# Altium schematic sheet 019_CC1352P.SchDoc
size 420 x 297 mm; Page Create Date: May 29, 2006; WebSite: https://www.seeedstudio.com; Variant Name: <Core Design>; Page Number: 19; Drawing: qxn; Schematic Name: BeaglePlay; Page Size: A3; Comment: Seeed Title; Page Count: 22; Page Name: 019_CC1352P; Company: Seeed Studio; RevCode: v0.2; DsnPath: C:\Users\a0488739\Documents\GitHub\beagleplay\allegro\DVT\BEAGLEPLAYV020_220915.DSN; SchematicName: BeaglePlay; PageName: 019_CC1352P; PageSize: A3; TopSchematic: True
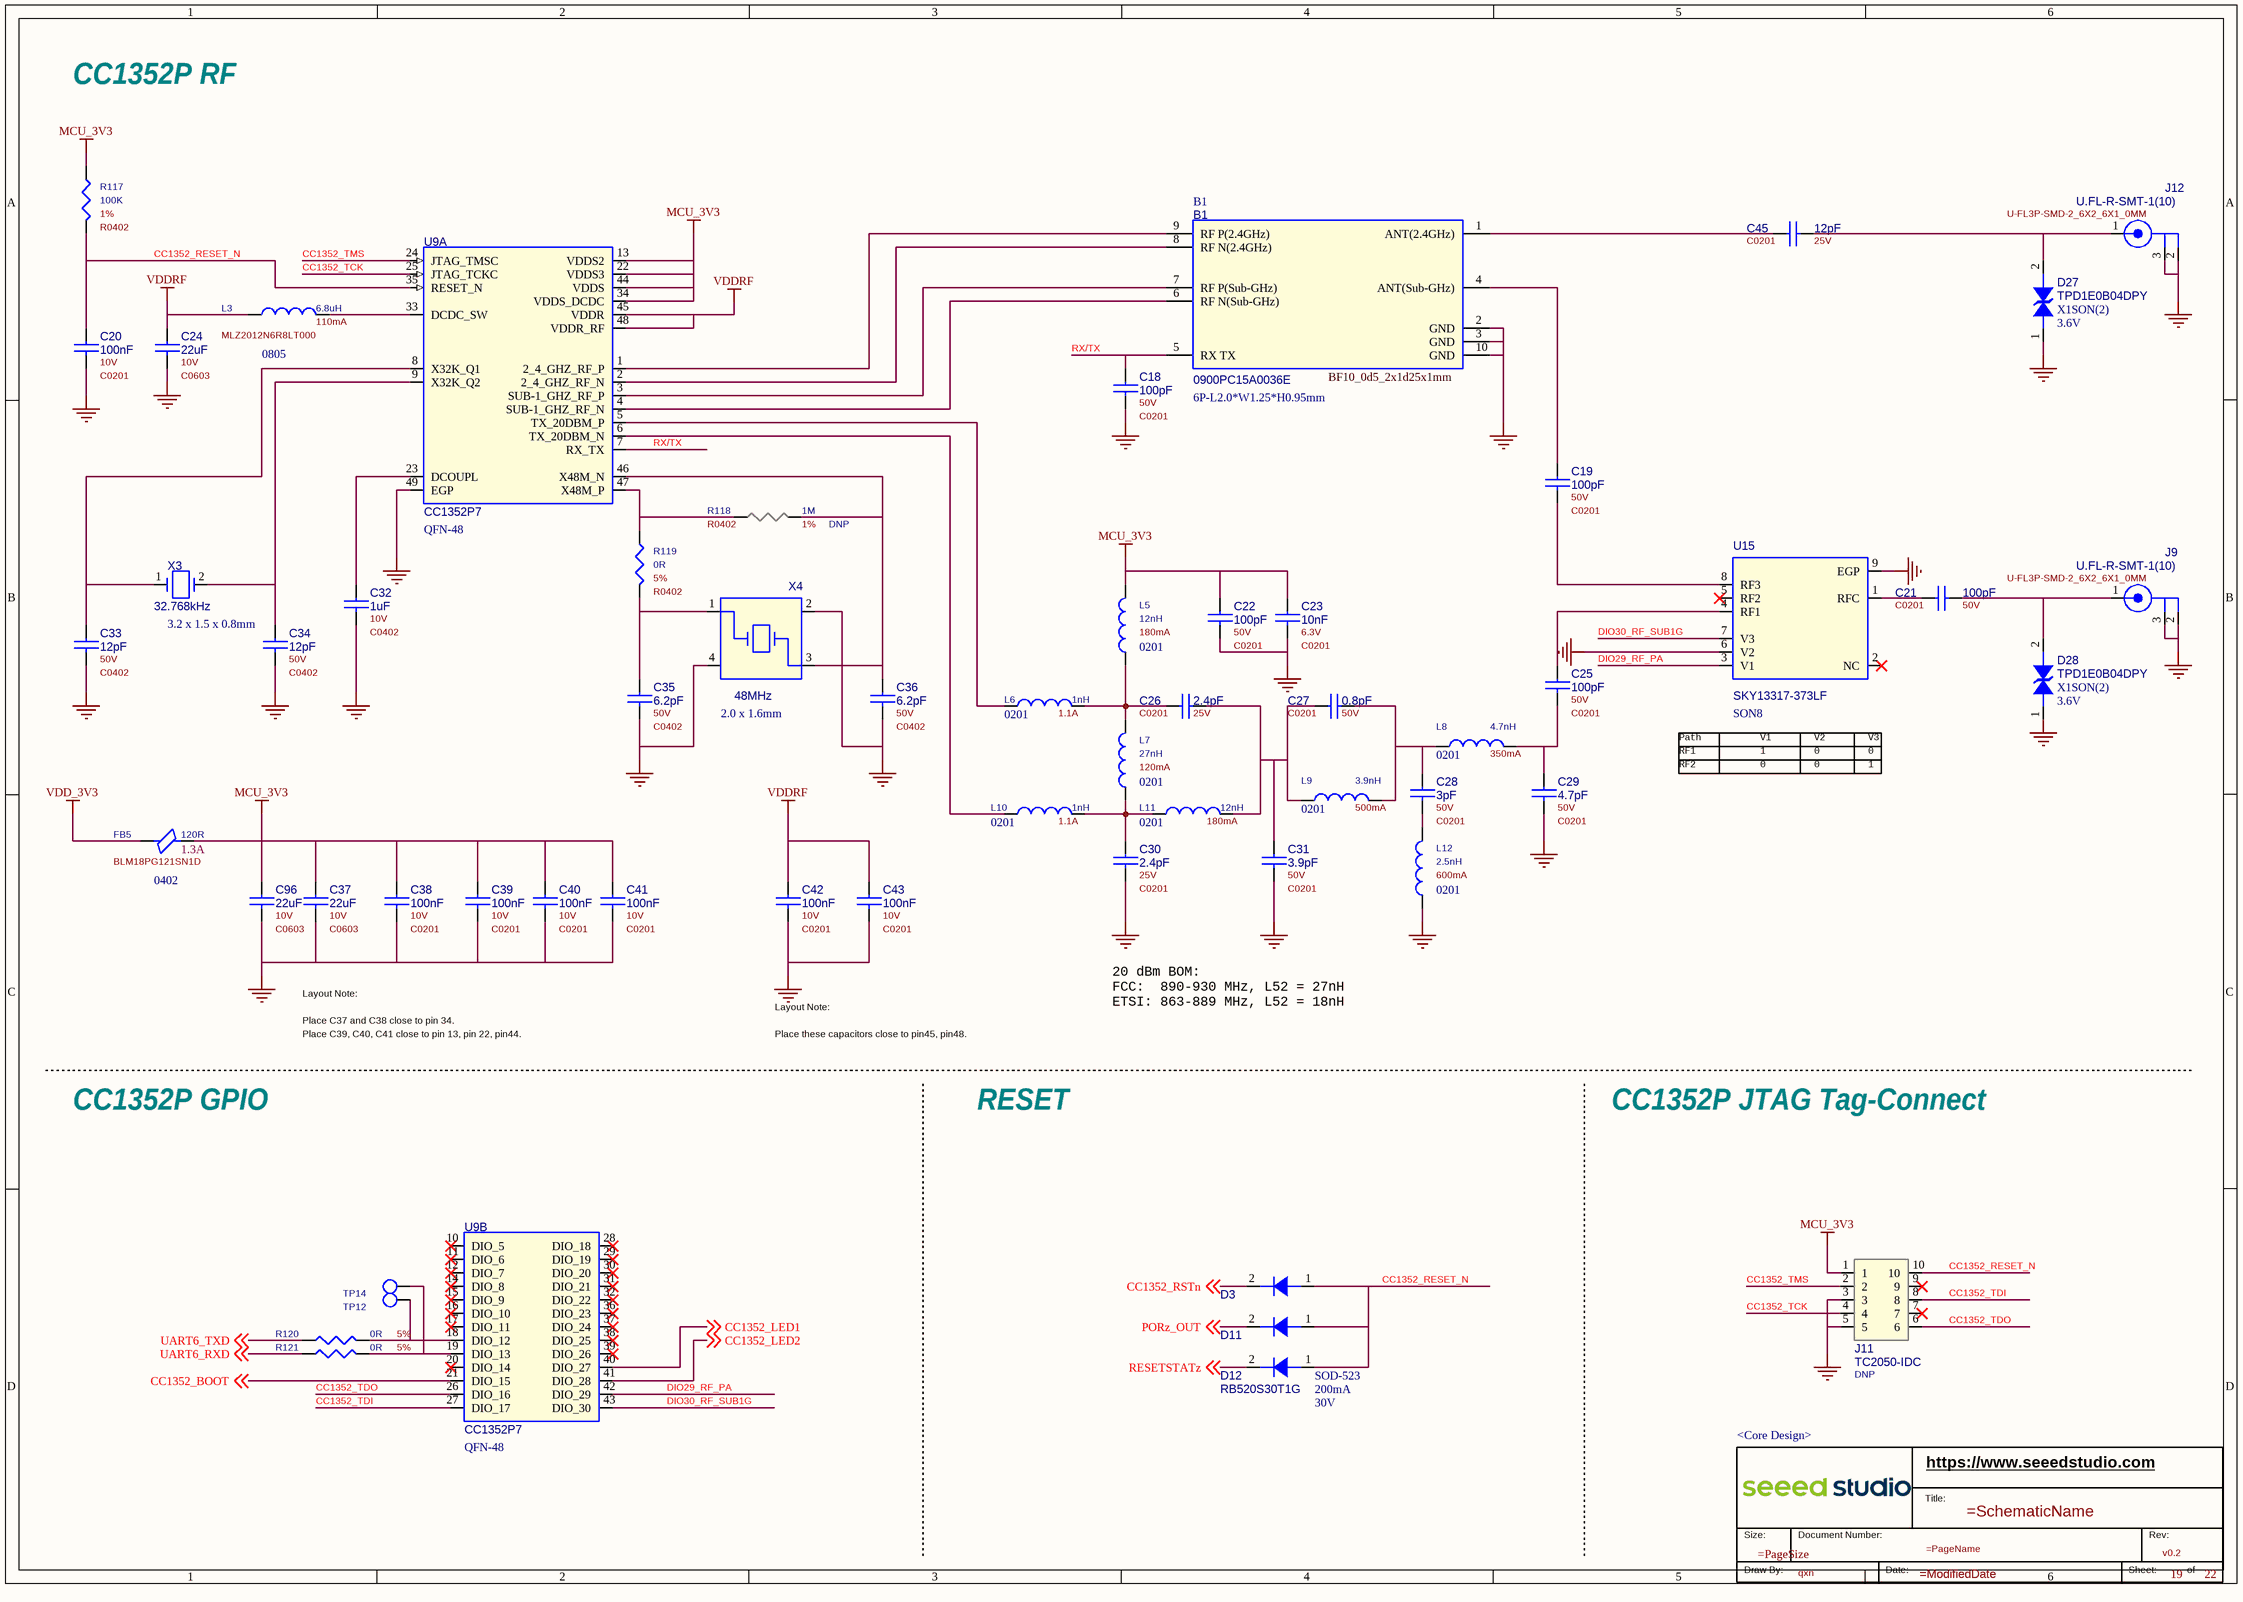
[diagram p0: 019_CC1352P.SchDoc]

## Parts
*  RevCode: v0.2  Page Number: 19  Page Count: 22  Drawing: qxn  Variant Name: <Core Design>  (hidden comment: Seeed Title)  (graphical)
B1  Reference: B1  Package Size: 6P-L2.0*W1.25*H0.95mm  [BF10_0d5_2x1d25x1mm]  (hidden comment: 0900PC15A0036E)
C18  value 100pF  Rating: 50V  [C0201]  (hidden comment: CC)
C19  value 100pF  Rating: 50V  [C0201]  (hidden comment: CC)
C20  value 100nF  Rating: 10V  [C0201]  (hidden comment: CC)
C21  value 100pF  Rating: 50V  [C0201]  (hidden comment: CC)
C22  value 100pF  Rating: 50V  [C0201]  (hidden comment: CC)
C23  value 10nF  Rating: 6.3V  [C0201]  (hidden comment: CC)
C24  value 22uF  Rating: 10V  [C0603]  (hidden comment: CC)
C25  value 100pF  Rating: 50V  [C0201]  (hidden comment: CC)
C26  value 2.4pF  Rating: 25V  [C0201]  (hidden comment: CC)
C27  value 0.8pF  Rating: 50V  [C0201]  (hidden comment: CC)
C28  value 3pF  Rating: 50V  [C0201]  (hidden comment: CC)
C29  value 4.7pF  Rating: 50V  [C0201]  (hidden comment: CC)
C30  value 2.4pF  Rating: 25V  [C0201]  (hidden comment: CC)
C31  value 3.9pF  Rating: 50V  [C0201]  (hidden comment: CC)
C32  value 1uF  Rating: 10V  [C0402]  (hidden comment: CC)
C33  value 12pF  Rating: 50V  [C0402]  (hidden comment: CC)
C34  value 12pF  Rating: 50V  [C0402]  (hidden comment: CC)
C35  value 6.2pF  Rating: 50V  [C0402]  (hidden comment: CC)
C36  value 6.2pF  Rating: 50V  [C0402]  (hidden comment: CC)
C37  value 22uF  Rating: 10V  [C0603]  (hidden comment: CC)
C38  value 100nF  Rating: 10V  [C0201]  (hidden comment: CC)
C39  value 100nF  Rating: 10V  [C0201]  (hidden comment: CC)
C40  value 100nF  Rating: 10V  [C0201]  (hidden comment: CC)
C41  value 100nF  Rating: 10V  [C0201]  (hidden comment: CC)
C42  value 100nF  Rating: 10V  [C0201]  (hidden comment: CC)
C43  value 100nF  Rating: 10V  [C0201]  (hidden comment: CC)
C45  value 12pF  Rating: 25V  [C0201]  (hidden comment: CC)
C96  value 22uF  Rating: 10V  [C0603]  (hidden comment: CC)
D3  D  [sod_523]  (value not drawn)
D11  D  [sod_523]  (value not drawn)
D12  value RB520S30T1G  Package Size: SOD-523  Peak Forward Current: 200mA  Repetitive Reverse Voltage Maximum: 30V  [sod_523]  (hidden comment: D)
D27  value TPD1E0B04DPY  Package Size: X1SON(2)  Rated Voltage: 3.6V  [x1son2_0d65_1x0_6x0_45mm]  (hidden comment: DIODE TVS BI-DIR)
D28  value TPD1E0B04DPY  Package Size: X1SON(2)  Rated Voltage: 3.6V  [x1son2_0d65_1x0_6x0_45mm]  (hidden comment: DIODE TVS BI-DIR)
FB5  value 120R  Rating: 1.3A  Manufacturer Part Number: BLM18PG121SN1D  Package Size: 0402  [L0402]  (hidden comment: FB)
J9  value U.FL-R-SMT-1(10)  [U-FL3P-SMD-2_6X2_6X1_0MM]  (hidden comment: RF ANT 3P)
J11  value TC2050-IDC  ASSY: DNP  [Connect10_1d27_12_4x6_7mm]  (hidden comment: Header 2X5_1)
J12  value U.FL-R-SMT-1(10)  [U-FL3P-SMD-2_6X2_6X1_0MM]  (hidden comment: RF ANT 3P)
L3  value 6.8uH  Manufacturer Part Number: MLZ2012N6R8LT000  Rating: 110mA  Package Size: 0805  [L0805]  (hidden comment: L)
L5  value 12nH  Rating: 180mA  Package Size: 0201  [L0201]  (hidden comment: L)
L6  value 1nH  Rating: 1.1A  Package Size: 0201  [L0201]  (hidden comment: L)
L7  value 27nH  Rating: 120mA  Package Size: 0201  [L0201]  (hidden comment: L)
L8  value 4.7nH  Rating: 350mA  Package Size: 0201  [L0201]  (hidden comment: L)
L9  value 3.9nH  Rating: 500mA  Package Size: 0201  [L0201]  (hidden comment: L)
L10  value 1nH  Rating: 1.1A  Package Size: 0201  [L0201]  (hidden comment: L)
L11  value 12nH  Rating: 180mA  Package Size: 0201  [L0201]  (hidden comment: L)
L12  value 2.5nH  Rating: 600mA  Package Size: 0201  [L0201]  (hidden comment: L)
R117  value 100K  Rating: 1%  [R0402]  (hidden comment: R)
R118  value 1M  Rating: 1%  ASSY: DNP  [R0402]  (hidden comment: R)
R119  value 0R  Rating: 5%  [R0402]  (hidden comment: R)
R120  value 0R  Rating: 5%  [R0402]  (hidden comment: R)
R121  value 0R  Rating: 5%  [R0402]  (hidden comment: R)
TP12  Test Point  [tp1-8040]  (value not drawn)
TP14  Test Point  [tp1-8040]  (value not drawn)
U9  value CC1352P7  Package Size: QFN-48  [qfn48_0d5_7x7mm]  (hidden comment: CC1352P1F3RGZ)  (parts A,B of 2)
U15  Package Size: SON8  [son8p_150x150x50mm]  (hidden comment: SKY13317-373LF)
X3  value 32.768kHz  Package Size: 3.2 x 1.5 x 0.8mm  [X2_SMD_3_2X1_5MM]  (hidden comment: XTAL_2P)
X4  value 48MHz  Package Size: 2.0 x 1.6mm  [x4_smd_2_0x1_6mm]  (hidden comment: XTAL_4P)

## Nets
GND: B1.2(GND) B1.3(GND) B1.10(GND) C18.2 C20.2 C22.2 C23.2 C24.2 C29.2 C30.2 C31.2 C32.2 C33.2 C34.2 C35.2 C36.2 C37.2 C38.2 C39.2 C40.2 C41.2 C42.2 C43.2 C96.2 D27.1 D28.1 J9.2(SHIELD1) J9.3(SHIELD2) J11.3 J11.5 J12.2(SHIELD1) J12.3(SHIELD2) L12.1 U9.49(EGP) U15.6(V2) U15.9(EGP) X4.2 X4.4
MCU_3V3: C22.1 C23.1 C37.1 C38.1 C39.1 C40.1 C41.1 C96.1 FB5.2 J11.1 L5.2 R117.1 U9.13(VDDS2) U9.22(VDDS3) U9.34(VDDS_DCDC) U9.44(VDDS)
VDD_3V3: FB5.1
VDDRF: C24.1 C42.1 C43.1 L3.1 U9.45(VDDR) U9.48(VDDR_RF)
CC1352_BOOT: U9.21(DIO_15) ; off-sheet CC1352_BOOT
CC1352_LED1: U9.40(DIO_27) ; off-sheet CC1352_LED1
CC1352_LED2: U9.41(DIO_28) ; off-sheet CC1352_LED2
CC1352_RESET_N: C20.1 D3.1(A) D11.1(A) D12.1(A) J11.10 R117.2 U9.35(RESET_N)
CC1352_RSTn: D3.2(C) ; off-sheet CC1352_RSTn
CC1352_TCK: J11.4 U9.25(JTAG_TCKC)
CC1352_TDI: J11.8 U9.27(DIO_17)
CC1352_TDO: J11.6 U9.26(DIO_16)
CC1352_TMS: J11.2 U9.24(JTAG_TMSC)
DIO29_RF_PA: U9.42(DIO_29) U15.3(V1)
DIO30_RF_SUB1G: U9.43(DIO_30) U15.7(V3)
PORz_OUT: D11.2(C) ; off-sheet PORz_OUT
RESETSTATz: D12.2(C) ; off-sheet RESETSTATz
RX/TX: B1.5(RX_TX) C18.1 U9.7(RX_TX)
UART6_RXD: R121.1 ; off-sheet UART6_RXD
UART6_TXD: R120.1 ; off-sheet UART6_TXD
NetB1_1: B1.1(ANT(2.4GHz)) C45.1
NetB1_4: B1.4(ANT(Sub-GHz)) C19.1
NetB1_6: B1.6(RF_N(Sub-GHz)) U9.4(SUB-1_GHZ_RF_N)
NetB1_7: B1.7(RF_P(Sub-GHz)) U9.3(SUB-1_GHZ_RF_P)
NetB1_8: B1.8(RF_N(2.4GHz)) U9.2(2_4_GHZ_RF_N)
NetB1_9: B1.9(RF_P(2.4GHz)) U9.1(2_4_GHZ_RF_P)
NetC19_2: C19.2 U15.8(RF3)
NetC21_1: C21.1 U15.1(RFC)
NetC21_2: C21.2 D28.2 J9.1(CENTER)
NetC25_1: C25.1 U15.4(RF1)
NetC25_2: C25.2 C29.1 L8.2
NetC26_1: C26.1 L5.1 L6.2 L7.2
NetC26_2: C26.2 C27.1 C31.1 L9.1 L11.2
NetC27_2: C27.2 C28.1 L8.1 L9.2
NetC28_2: C28.2 L12.2
NetC30_1: C30.1 L7.1 L10.2 L11.1
NetC32_1: C32.1 U9.23(DCOUPL)
NetC33_1: C33.1 U9.8(X32K_Q1) X3.1
NetC34_1: C34.1 U9.9(X32K_Q2) X3.2
NetC35_1: C35.1 R119.2 X4.1
NetC36_1: C36.1 R118.2 U9.46(X48M_N) X4.3
NetC45_2: C45.2 D27.2 J12.1(CENTER)
NetL3_2: L3.2 U9.33(DCDC_SW)
NetL6_1: L6.1 U9.5(TX_20DBM_P)
NetL10_1: L10.1 U9.6(TX_20DBM_N)
NetR118_1: R118.1 R119.1 U9.47(X48M_P)
NetR120_2: R120.2 TP12.1(TP) U9.18(DIO_12)
NetR121_2: R121.2 TP14.1(TP) U9.19(DIO_13)

Not connected (* = marked no-connect by the designer): J11 7* 9*; U9 10(DIO_5)* 11(DIO_6)* 12(DIO_7)* 14(DIO_8)* 15(DIO_9)* 16(DIO_10)* 17(DIO_11)* 20(DIO_14)* 28(DIO_18)* 29(DIO_19)* 30(DIO_20)* 31(DIO_21)* 32(DIO_22)* 36(DIO_23)* 37(DIO_24)* 38(DIO_25)* 39(DIO_26)*; U15 2(NC)* 5(RF2)*

## Notes on the sheet
- CC1352P RF
- Path
- RF1
- RF2
- V1
- 0
- 1
- V2
- V3
- Layout Note:
- 20 dBm BOM:
  FCC:  890-930 MHz, L52 = 27nH
  ETSI: 863-889 MHz, L52 = 18nH
- Place C39, C40, C41 close to pin 13, pin 22, pin44.
- Place C37 and C38 close to pin 34.
- Place these capacitors close to pin45, pin48.
- CC1352P GPIO
- RESET
- CC1352P JTAG Tag-Connect
- (in symbol Seeed Title) https://www.seeedstudio.com; Title:; Size:; Document Number:; Rev:; Draw By:; Date:; Sheet:; of

## Library data of the parts
* = Seeed Title: Company: Seeed Studio; WebSite: https://www.seeedstudio.com; Schematic Name: =SchematicName; Page Size: =PageSize; Page Name: =PageName; Page Create Date: May 29, 2006; Page Modify Date: =ModifiedDate
B1 = 0900PC15A0036E: MISC, Balun, 0900PC15A0036E, SMD, 6P-L2.0*W1.25*H0.95mm; Manufacturer: Johanson; Company Part Status: BeaglePlay; PN: 310060581; CLASS: DISCRETE; PCB Footprint: BF10_0d5_2x1d25x1mm; Value: 0900PC15A0036E; Part Reference: B1; Manufacturer Part Number: 0900PC15A0036E; Manufacturer PN: 0900PC15A0036E
C18 = CC: CAP, Ceramic, SMD, 100pF, 5%, 50V, 0201; Part Reference: C18; Manufacturer PN: CC0201JRNPO9BN101; Company Part Status: BeaglePlay; Manufacturer Part Number: CC0402JRNPO9BN101; Manufacturer: YAGEO; CLASS: DISCRETE; PN: 302010420; Temperature Coefficient: NPO; PCB Footprint: C0201; Tolerance: 5%; Dielectric Type: Ceramic; Package Size: 0201; Temperature: -55¡ãC to 125¡ãC; Status: Testo PoE; Part Type: Ceramic
C19 = CC: CAP, Ceramic, SMD, 100pF, 5%, 50V, 0201; Part Reference: C19; Manufacturer: YAGEO; Manufacturer Part Number: CC0402JRNPO9BN101; Company Part Status: BeaglePlay; Manufacturer PN: CC0201JRNPO9BN101; Temperature Coefficient: NPO; PN: 302010420; CLASS: DISCRETE; PCB Footprint: C0201; Part Type: Ceramic; Status: Testo PoE; Temperature: -55¡ãC to 125¡ãC; Package Size: 0201; Dielectric Type: Ceramic; Tolerance: 5%
C20 = CC: CAP, Ceramic, SMD, 100nF, 10%, 10V, 0201; Part Reference: C20; Manufacturer PN: CC0201KRX5R6BB104; Company Part Status: ODYSSEY-i.MX8M; Manufacturer Part Number: CC0402KRX7R7BB104; Manufacturer: YAGEO; CLASS: DISCRETE; Temperature Coefficient: X5R; PN: 302010271; PCB Footprint: C0201; Tolerance: 10%; Dielectric Type: Ceramic; Package Size: 0201; Temperature: -55¡ãC to 125¡ãC; Status: BeagleBone Carrier Board; Part Type: Ceramic
C21 = CC: CAP, Ceramic, SMD, 100pF, 5%, 50V, 0201; Part Reference: C21; Manufacturer PN: CC0201JRNPO9BN101; Company Part Status: BeaglePlay; Manufacturer Part Number: CC0402JRNPO9BN101; Manufacturer: YAGEO; CLASS: DISCRETE; PN: 302010420; Temperature Coefficient: NPO; PCB Footprint: C0201; Tolerance: 5%; Dielectric Type: Ceramic; Package Size: 0201; Temperature: -55¡ãC to 125¡ãC; Status: Testo PoE; Part Type: Ceramic
C22 = CC: CAP, Ceramic, SMD, 100pF, 5%, 50V, 0201; Part Reference: C22; Manufacturer PN: CC0201JRNPO9BN101; Company Part Status: BeaglePlay; Manufacturer Part Number: CC0402JRNPO9BN101; Manufacturer: YAGEO; CLASS: DISCRETE; PN: 302010420; Temperature Coefficient: NPO; PCB Footprint: C0201; Tolerance: 5%; Dielectric Type: Ceramic; Package Size: 0201; Temperature: -55¡ãC to 125¡ãC; Status: Testo PoE; Part Type: Ceramic
C23 = CC: CAP, Ceramic, SMD, 10nF, 10%, 6.3V, 0201; Part Reference: C23; Manufacturer PN: CC0201KRX5R5BB103; Company Part Status: ODYSSEY-i.MX8M; Manufacturer: YAGEO; Manufacturer Part Number: CC0402KRX7R9BB103; CLASS: DISCRETE; Temperature Coefficient: X5R; PN: 302011831; PCB Footprint: C0201; Tolerance: 10%; Dielectric Type: Ceramic; Package Size: 0201; Part Type: Ceramic; Status: BeagleBone Carrier Board; Temperature: -55¡ãC to 125¡ãC
C24 = CC: CAP, Ceramic, SMD, 22uF, 20%, 10V, 0603; Part Reference: C24; Manufacturer PN: CC0603MRX5R6BB226; Manufacturer: YAGEO; CLASS: DISCRETE; Temperature Coefficient: X5R; PN: 302010411; PCB Footprint: C0603; Tolerance: 20%; Dielectric Type: Ceramic; Package Size: 0603; Manufacturer Part Number: CC0603MRX5R6BB226; Part Type: Ceramic; Temperature: -55¡ãC to 85¡ãC
C25 = CC: CAP, Ceramic, SMD, 100pF, 5%, 50V, 0201; Part Reference: C25; Manufacturer PN: CC0201JRNPO9BN101; Company Part Status: BeaglePlay; Manufacturer Part Number: CC0402JRNPO9BN101; Manufacturer: YAGEO; CLASS: DISCRETE; PN: 302010420; Temperature Coefficient: NPO; PCB Footprint: C0201; Tolerance: 5%; Dielectric Type: Ceramic; Package Size: 0201; Temperature: -55¡ãC to 125¡ãC; Status: Testo PoE; Part Type: Ceramic
C26 = CC: CAP, Ceramic, SMD, 2.4pF, 0.25pF, 25V, 0201; Part Reference: C26; Manufacturer PN: GJM0335C1E2R4CB01D; Company Part Status: BeaglePlay; Manufacturer: Murata; Manufacturer Part Number: CC0402CRNPO9BN2R4; CLASS: DISCRETE; Temperature Coefficient: COG; PN: 302012904; PCB Footprint: C0201; Tolerance: 0.25pF; Dielectric Type: Ceramic; Package Size: 0201; Part Type: Ceramic; Status: Amazon Sidewalk Module; Temperature: -55¡ãC to 125¡ãC
C27 = CC: CAP, Ceramic, SMD, 0.8pF, 0.01pF, 50V, 0201; Part Reference: C27; Manufacturer PN: GRM0335C1HR80BA01D; Company Part Status: BeaglePlay; Manufacturer Part Number: CC0402BRNPO9BNR80; Manufacturer: Murata; CLASS: DISCRETE; Temperature Coefficient: COG; PN: 302011837; PCB Footprint: C0201; Tolerance: 0.01pF; Dielectric Type: Ceramic; Package Size: 0201; Temperature: -55¡ãC to 125¡ãC; Status: Amazon Sidewalk Module; Part Type: Ceramic
C28 = CC: CAP, Ceramic, SMD, 3pF, 0.1pF, 50V, 0201; Part Reference: C28; Manufacturer PN: CC0201BRNPO9BN3R0; Company Part Status: LR1110; Manufacturer Part Number: GRM1555C1H3R0WA01D; Manufacturer: YAGEO; CLASS: DISCRETE; Temperature Coefficient: NPO; PN: 302013024; PCB Footprint: C0201; Tolerance: 0.1pF; Dielectric Type: Ceramic; Package Size: 0201; Temperature: -55¡ãC to 125¡ãC; Status: Zola Dongle; Part Type: Ceramic
C29 = CC: CAP, Ceramic, SMD, 4.7pF, 0.25pF, 50V, 0201; Part Reference: C29; Manufacturer PN: GJM0335C1H4R7BB01D; Company Part Status: BeaglePlay; Manufacturer: Murata; Manufacturer Part Number: CC0402CRNPO9BN4R7; CLASS: DISCRETE; Temperature Coefficient: COG; PN: 302012908; PCB Footprint: C0201; Tolerance: 0.25pF; Dielectric Type: Ceramic; Package Size: 0201; Part Type: Ceramic; Status: Mini-Gateway; Temperature: -55¡ãC to 125¡ãC
C30 = CC: CAP, Ceramic, SMD, 2.4pF, 0.25pF, 25V, 0201; Part Reference: C30; Manufacturer PN: GJM0335C1E2R4CB01D; Company Part Status: BeaglePlay; Manufacturer: Murata; Manufacturer Part Number: CC0402CRNPO9BN2R4; CLASS: DISCRETE; Temperature Coefficient: COG; PN: 302012904; PCB Footprint: C0201; Tolerance: 0.25pF; Dielectric Type: Ceramic; Package Size: 0201; Part Type: Ceramic; Status: Amazon Sidewalk Module; Temperature: -55¡ãC to 125¡ãC
C31 = CC: CAP, Ceramic, SMD, 3.9pF, 0.1pF, 50V, 0201; Part Reference: C31; Manufacturer PN: GJM0335C1H3R9BB01D; Company Part Status: BeaglePlay; Manufacturer Part Number: GJM1555C1H3R9BB01D; Manufacturer: Murata; CLASS: DISCRETE; Temperature Coefficient: COG; PN: 302012906; PCB Footprint: C0201; Tolerance: 0.1pF; Dielectric Type: Ceramic; Package Size: 0201; Temperature: -55¡ãC to 125¡ãC; Status: Amazon Sidewalk Module; Part Type: Ceramic
C32 = CC: CAP, Ceramic, SMD, 1uF, 10%, 10V, 0402; Part Reference: C32; Manufacturer PN: CC0402KRX5R6BB105; Company Part Status: BeagleBone Carrier Board; Manufacturer: YAGEO; CLASS: DISCRETE; Temperature Coefficient: X5R; PN: 302010040; PCB Footprint: C0402; Tolerance: 10%; Dielectric Type: Ceramic; Package Size: 0402; Manufacturer Part Number: CC0402KRX5R6BB105; Part Type: Ceramic; Status: BeagleBone Carrier Board; Temperature: -55¡ãC to 85¡ãC
C33 = CC: CAP, Ceramic, SMD, 12pF, 5%, 50V, 0402; Part Reference: C33; Manufacturer PN: CC0402JRNPO9BN120; Company Part Status: BeaglePlay; Manufacturer: YAGEO; CLASS: DISCRETE; Temperature Coefficient: NPO; PN: 302010049; PCB Footprint: C0402; Tolerance: 5%; Dielectric Type: Ceramic; Package Size: 0402; Temperature: -55¡ãC to 125¡ãC; Status: Testo PoE; Part Type: Ceramic; Manufacturer Part Number: CC0402JRNPO9BN120
C34 = CC: CAP, Ceramic, SMD, 12pF, 5%, 50V, 0402; Part Reference: C34; Manufacturer PN: CC0402JRNPO9BN120; Company Part Status: BeaglePlay; Manufacturer: YAGEO; CLASS: DISCRETE; Temperature Coefficient: NPO; PN: 302010049; PCB Footprint: C0402; Tolerance: 5%; Dielectric Type: Ceramic; Package Size: 0402; Temperature: -55¡ãC to 125¡ãC; Status: Testo PoE; Part Type: Ceramic; Manufacturer Part Number: CC0402JRNPO9BN120
C35 = CC: CAP, Ceramic, SMD, 6.2pF, 0.25pF, 50V, 0402; Part Reference: C35; Manufacturer PN: GJM1555C1H6R2CB01D; Company Part Status: BeaglePlay; Manufacturer: Murata; CLASS: DISCRETE; Temperature Coefficient: C0G; PN: 302010303; PCB Footprint: C0402; Tolerance: 0.25pF; Dielectric Type: Ceramic; Package Size: 0402; Manufacturer Part Number: GJM1555C1H6R2CB01D; Part Type: Ceramic; Status: Zola Dongle; Temperature: -55¡ãC to 125¡ãC
C36 = CC: CAP, Ceramic, SMD, 6.2pF, 0.25pF, 50V, 0402; Part Reference: C36; Manufacturer PN: GJM1555C1H6R2CB01D; Company Part Status: BeaglePlay; Manufacturer: Murata; CLASS: DISCRETE; Temperature Coefficient: C0G; PN: 302010303; PCB Footprint: C0402; Tolerance: 0.25pF; Dielectric Type: Ceramic; Package Size: 0402; Manufacturer Part Number: GJM1555C1H6R2CB01D; Part Type: Ceramic; Status: Zola Dongle; Temperature: -55¡ãC to 125¡ãC
C37 = CC: CAP, Ceramic, SMD, 22uF, 20%, 10V, 0603; Part Reference: C37; Manufacturer PN: CC0603MRX5R6BB226; Manufacturer: YAGEO; CLASS: DISCRETE; Temperature Coefficient: X5R; PN: 302010411; PCB Footprint: C0603; Tolerance: 20%; Dielectric Type: Ceramic; Package Size: 0603; Manufacturer Part Number: CC0603MRX5R6BB226; Part Type: Ceramic; Temperature: -55¡ãC to 85¡ãC
C38 = CC: CAP, Ceramic, SMD, 100nF, 10%, 10V, 0201; Part Reference: C38; Manufacturer PN: CC0201KRX5R6BB104; Company Part Status: ODYSSEY-i.MX8M; Manufacturer: YAGEO; Manufacturer Part Number: CC0402KRX7R7BB104; CLASS: DISCRETE; Temperature Coefficient: X5R; PN: 302010271; PCB Footprint: C0201; Tolerance: 10%; Dielectric Type: Ceramic; Package Size: 0201; Part Type: Ceramic; Status: BeagleBone Carrier Board; Temperature: -55¡ãC to 125¡ãC
C39 = CC: CAP, Ceramic, SMD, 100nF, 10%, 10V, 0201; Part Reference: C39; Manufacturer PN: CC0201KRX5R6BB104; Company Part Status: ODYSSEY-i.MX8M; Manufacturer Part Number: CC0402KRX7R7BB104; Manufacturer: YAGEO; CLASS: DISCRETE; Temperature Coefficient: X5R; PN: 302010271; PCB Footprint: C0201; Tolerance: 10%; Dielectric Type: Ceramic; Package Size: 0201; Temperature: -55¡ãC to 125¡ãC; Status: BeagleBone Carrier Board; Part Type: Ceramic
C40 = CC: CAP, Ceramic, SMD, 100nF, 10%, 10V, 0201; Part Reference: C40; Manufacturer PN: CC0201KRX5R6BB104; Company Part Status: ODYSSEY-i.MX8M; Manufacturer Part Number: CC0402KRX7R7BB104; Manufacturer: YAGEO; CLASS: DISCRETE; Temperature Coefficient: X5R; PN: 302010271; PCB Footprint: C0201; Tolerance: 10%; Dielectric Type: Ceramic; Package Size: 0201; Temperature: -55¡ãC to 125¡ãC; Status: BeagleBone Carrier Board; Part Type: Ceramic
C41 = CC: CAP, Ceramic, SMD, 100nF, 10%, 10V, 0201; Part Reference: C41; Manufacturer PN: CC0201KRX5R6BB104; Company Part Status: ODYSSEY-i.MX8M; Manufacturer Part Number: CC0402KRX7R7BB104; Manufacturer: YAGEO; CLASS: DISCRETE; Temperature Coefficient: X5R; PN: 302010271; PCB Footprint: C0201; Tolerance: 10%; Dielectric Type: Ceramic; Package Size: 0201; Temperature: -55¡ãC to 125¡ãC; Status: BeagleBone Carrier Board; Part Type: Ceramic
C42 = CC: CAP, Ceramic, SMD, 100nF, 10%, 10V, 0201; Part Reference: C42; Manufacturer: YAGEO; Manufacturer Part Number: CC0402KRX7R7BB104; Company Part Status: ODYSSEY-i.MX8M; Manufacturer PN: CC0201KRX5R6BB104; PN: 302010271; Temperature Coefficient: X5R; CLASS: DISCRETE; PCB Footprint: C0201; Part Type: Ceramic; Status: BeagleBone Carrier Board; Temperature: -55¡ãC to 125¡ãC; Package Size: 0201; Dielectric Type: Ceramic; Tolerance: 10%
C43 = CC: CAP, Ceramic, SMD, 100nF, 10%, 10V, 0201; Part Reference: C43; Manufacturer Part Number: CC0402KRX7R7BB104; Manufacturer: YAGEO; Company Part Status: ODYSSEY-i.MX8M; Manufacturer PN: CC0201KRX5R6BB104; PN: 302010271; Temperature Coefficient: X5R; CLASS: DISCRETE; PCB Footprint: C0201; Temperature: -55¡ãC to 125¡ãC; Status: BeagleBone Carrier Board; Part Type: Ceramic; Package Size: 0201; Dielectric Type: Ceramic; Tolerance: 10%
C45 = CC: CAP, Ceramic, SMD, 12pF, 5%, 25V, 0201; Part Reference: C45; Manufacturer PN: CC0201JRNPO8BN120; Company Part Status: BeaglePlay; Manufacturer Part Number: CC0402JRNPO9BN101; Manufacturer: YAGEO; CLASS: DISCRETE; PN: 302010424; Temperature Coefficient: NPO; PCB Footprint: C0201; Tolerance: 5%; Dielectric Type: Ceramic; Package Size: 0201; Temperature: -55¡ãC to 125¡ãC; Status: Testo PoE; Part Type: Ceramic
C96 = CC: CAP, Ceramic, SMD, 22uF, 20%, 10V, 0603; Part Reference: C96; Manufacturer PN: CC0603MRX5R6BB226; Manufacturer: YAGEO; CLASS: DISCRETE; Temperature Coefficient: X5R; PN: 302010411; PCB Footprint: C0603; Tolerance: 20%; Dielectric Type: Ceramic; Package Size: 0603; Manufacturer Part Number: CC0603MRX5R6BB226; Part Type: Ceramic; Temperature: -55¡ãC to 85¡ãC
D3 = D: DIO, Schottky, RB520S30T1G, , , , SOD-523; Part Reference: D3; Manufacturer: ON; Company Part Status: SCG Vehicle Device; CLASS: DISCRETE; Repetitive Reverse Voltage Maximum: 30V; Peak Forward Current: 200mA; PN: 304020782; PCB Footprint: sod_523; Value: RB520S30T1G; Manufacturer PN: RB520S30T1G; Package Size: SOD-523
D11 = D: DIO, Schottky, RB520S30T1G, , , , SOD-523; Part Reference: D11; Manufacturer: ON; Company Part Status: SCG Vehicle Device; CLASS: DISCRETE; Repetitive Reverse Voltage Maximum: 30V; Peak Forward Current: 200mA; PN: 304020782; PCB Footprint: sod_523; Value: RB520S30T1G; Manufacturer PN: RB520S30T1G; Package Size: SOD-523
D12 = D: DIO, Schottky, RB520S30T1G, , , , SOD-523; Part Reference: D12; Company Part Status: SCG Vehicle Device; Manufacturer: ON; PN: 304020782; CLASS: DISCRETE; PCB Footprint: sod_523; Manufacturer PN: RB520S30T1G
D27 = DIODE TVS BI-DIR: DIO, ESD, TPD1E0B04DPY, --, 3.6V, --, X1SON(2); Part Reference: D27; Company Part Status: BeaglePlay; Manufacturer: TI; Manufacturer PN: TPD1E0B04DPYR; PN: 304051038; CLASS: DISCRETE; PCB Footprint: x1son2_0d65_1x0_6x0_45mm
D28 = DIODE TVS BI-DIR: DIO, ESD, TPD1E0B04DPY, --, 3.6V, --, X1SON(2); Part Reference: D28; Company Part Status: BeaglePlay; Manufacturer: TI; Manufacturer PN: TPD1E0B04DPYR; PN: 304051038; CLASS: DISCRETE; PCB Footprint: x1son2_0d65_1x0_6x0_45mm
FB5 = FB: Ferrite Bead, 120R, , 1.3A, 0402; Part Reference: FB5; Manufacturer: Murata; Company Part Status: BeagleBone Carrier Board; Manufacturer PN: BLM15PD121SN1D; PN: 303030040; CLASS: DISCRETE; PCB Footprint: L0402; Part Type: Ferrite Bead; Status: BeagleBone Carrier Board; Temperature: -55¡ãC to 125¡ãC
J9 = RF ANT 3P: CONN, RF Connector, 3P, SMD; Part Reference: J9; Manufacturer: HRS; Company Part Status: Seeed BeagleBone Green Gateway; CLASS: IO; PN: 320111077; PCB Footprint: U-FL3P-SMD-2_6X2_6X1_0MM; Manufacturer PN: U.FL-R-SMT-1(10); Package Size: 3P-L2.6*W2.6*H1.25mm
J11 = Header 2X5_1: CONN, Header, TC2050-IDC, 2*5P, SMD; Part Reference: J11; Company Part Status: RV PI; PN: TMP-43; CLASS: IO; PCB Footprint: Connect10_1d27_12_4x6_7mm
J12 = RF ANT 3P: CONN, RF Connector, 3P, SMD; Part Reference: J12; Manufacturer: HRS; Company Part Status: Seeed BeagleBone Green Gateway; CLASS: IO; PN: 320111077; PCB Footprint: U-FL3P-SMD-2_6X2_6X1_0MM; Manufacturer PN: U.FL-R-SMT-1(10); Package Size: 3P-L2.6*W2.6*H1.25mm
L3 = L: Power Inductor, 6.8uH, 20%, 110mA, 0805; Part Reference: L3; Company Part Status: BealgePlay; Manufacturer: TDK; CLASS: DISCRETE; PN: 303011320; PCB Footprint: L0805; Manufacturer PN: MLZ2012N6R8LT000; Temperature: -55¡ãC to 125¡ãC; Status: Zola Dongle; Part Type: Inductor
L5 = L: Inductor, 12nH, 3%, 180mA, 0201; Manufacturer Part Number: LQW15AN12NG00D; Part Reference: L5; Manufacturer: Murata; Company Part Status: BeaglePlay; Manufacturer PN: LQP03TG12NH02D; PN: 303011637; CLASS: DISCRETE; PCB Footprint: L0201; Part Type: Inductor; Status: Jetson Nano; Temperature: -55¡ãC to 125¡ãC
L6 = L: Inductor, 1nH, 0.05nH, 1.1A, 0201; Manufacturer Part Number: LQG15HS1N0S02D; Part Reference: L6; Manufacturer: Murata; Company Part Status: BeaglePlay; Manufacturer PN: LQP03HQ1N0W02D; PN: 303011219; CLASS: DISCRETE; PCB Footprint: L0201; Temperature: -55¡ãC to 125¡ãC; Status: Jetson Nano; Part Type: Inductor
L7 = L: Inductor, 27nH, 3%, 120mA, 0201; Manufacturer Part Number: LQW15AN18NG00; Part Reference: L7; Manufacturer: Murata; Manufacturer PN: LQP03TG27NH02D; Company Part Status: BeaglePlay; PN: 303011639; CLASS: DISCRETE; PCB Footprint: L0201; Part Type: Inductor
L8 = L: Inductor, 4.7nH, 5%, 350mA, 0201; Manufacturer Part Number: LQW15AN4N7C00D; Part Reference: L8; Manufacturer: Murata; Company Part Status: BeaglePlay; Manufacturer PN: LQP03TN4N7J02D; PN: 303010096; CLASS: DISCRETE; PCB Footprint: L0201; Part Type: Inductor; Status: Zola Dongle; Temperature: -55¡ãC to 125¡ãC
L9 = L: Inductor, 3.9nH, 0.1nH, 500mA, 0201; Manufacturer Part Number: LQW15AN3N9B00D; Part Reference: L9; Manufacturer: Murata; Company Part Status: BeaglePlay; Manufacturer PN: LQP03HQ3N9B02D; PN: 303011225; CLASS: DISCRETE; PCB Footprint: L0201; Part Type: Inductor; Status: Zola Dongle; Temperature: -55¡ãC to 125¡ãC
L10 = L: Inductor, 1nH, 0.05nH, 1.1A, 0201; Manufacturer Part Number: LQG15HS1N0S02D; Part Reference: L10; Manufacturer PN: LQP03HQ1N0W02D; Company Part Status: BeaglePlay; Manufacturer: Murata; CLASS: DISCRETE; PN: 303011219; PCB Footprint: L0201; Part Type: Inductor; Status: Jetson Nano; Temperature: -55¡ãC to 125¡ãC
L11 = L: Inductor, 12nH, 3%, 180mA, 0201; Manufacturer Part Number: LQW15AN12NG00D; Part Reference: L11; Manufacturer: Murata; Company Part Status: BeaglePlay; Manufacturer PN: LQP03TG12NH02D; PN: 303011637; CLASS: DISCRETE; PCB Footprint: L0201; Part Type: Inductor; Status: Jetson Nano; Temperature: -55¡ãC to 125¡ãC
L12 = L: Inductor, 2.5nH, 0.1nH, 600mA, 0201; Manufacturer Part Number: LQW15AN2N5B00D; Part Reference: L12; Manufacturer: Murata; Company Part Status: BeaglePlay; Manufacturer PN: LQP03HQ2N5B02D; PN: 303011636; CLASS: DISCRETE; PCB Footprint: L0201; Part Type: Inductor; Status: Amazon Sidewalk Module; Temperature: -55¡ãC to 125¡ãC
R117 = R: RES, Thick Film, 100K, 1%, 1/16W, SMD, 0402; Part Reference: R117; Manufacturer PN: RC0402FR-07100KL; Company Part Status: BeagleBone Carrier Board; Manufacturer: YAGEO; CLASS: DISCRETE; PN: 301010456; PCB Footprint: R0402; Rated Power: 1/16W; Package Size: 0402; Temperature: -55¡ãC to 155¡ãC; Status: BeagleBone Carrier Board; Part Type: RES; Manufacturer Part Number: RC0402FR-07100KL
R118 = R: RES, Thick Film, 1M, 1%, 1/16W, SMD, 0402; Part Reference: R118; Manufacturer PN: RC0402FR-071ML; Company Part Status: BeagleBone Carrier Board; Manufacturer: YAGEO; CLASS: DISCRETE; PN: 301010043; PCB Footprint: R0402; Rated Power: 1/16W; Package Size: 0402; Temperature: -55¡ãC to 155¡ãC; Status: BeagleBone Carrier Board; Part Type: RES; Manufacturer Part Number: RC0402FR-071ML
R119 = R: RES, Thick Film, 0R, 5%, 1/16W, SMD, 0402; Part Reference: R119; Manufacturer PN: RC0402JR-070RL; Company Part Status: BeagleBone Carrier Board; Manufacturer: YAGEO; CLASS: DISCRETE; PN: 301010000; PCB Footprint: R0402; Rated Power: 1/16W; Package Size: 0402; Manufacturer Part Number: RC0402JR-070RL; Part Type: RES; Status: BeagleBone Carrier Board; Temperature: -55¡ãC to 155¡ãC; Datasheet: Y:\01_Cadence_Library\05_Datasheet\301010000_YAGEO_RC0402JR-070RL_Datasheet.pdf
R120 = R: RES, Thick Film, 0R, 5%, 1/16W, SMD, 0402; Part Reference: R120; Manufacturer PN: RC0402JR-070RL; Company Part Status: BeagleBone Carrier Board; Manufacturer: YAGEO; CLASS: DISCRETE; PN: 301010000; PCB Footprint: R0402; Rated Power: 1/16W; Package Size: 0402; Datasheet: Y:\01_Cadence_Library\05_Datasheet\301010000_YAGEO_RC0402JR-070RL_Datasheet.pdf; Temperature: -55¡ãC to 155¡ãC; Status: BeagleBone Carrier Board; Part Type: RES; Manufacturer Part Number: RC0402JR-070RL
R121 = R: RES, Thick Film, 0R, 5%, 1/16W, SMD, 0402; Part Reference: R121; Manufacturer PN: RC0402JR-070RL; Company Part Status: BeagleBone Carrier Board; Manufacturer: YAGEO; CLASS: DISCRETE; PN: 301010000; PCB Footprint: R0402; Rated Power: 1/16W; Package Size: 0402; Datasheet: Y:\01_Cadence_Library\05_Datasheet\301010000_YAGEO_RC0402JR-070RL_Datasheet.pdf; Temperature: -55¡ãC to 155¡ãC; Status: BeagleBone Carrier Board; Part Type: RES; Manufacturer Part Number: RC0402JR-070RL
TP12 = Test Point: MISC, Test Point, Test Point, SMD, TP35S_SMD; Part Reference: TP12; Company Part Status: Mini-Gateway; ASSY: DNP; CLASS: DISCRETE; PCB Footprint: TP35S_SMD; Value: Test Point; Package Size: TP35S_SMD; PN: TP35S_SMD
TP14 = Test Point: MISC, Test Point, Test Point, SMD, TP35S_SMD; Part Reference: TP14; Company Part Status: Mini-Gateway; ASSY: DNP; CLASS: DISCRETE; PCB Footprint: TP35S_SMD; Value: Test Point; Package Size: TP35S_SMD; PN: TP35S_SMD
U9 = CC1352P1F3RGZ: IC, Controller, MCU, CC1352P7, QFN-48; Part Reference: U9; Manufacturer PN: CC1352P74T0RGZR; Company Part Status: BeaglePlay; Manufacturer: TI; Manufacturer Part Number: CC1352P1F3RGZT; Supply Voltage: 2.0 to 3.6V; PN: 310011579; Rating: 2.4G,SUB 1G; PCB Footprint: qfn48_0d5_7x7mm; CLASS: IC; Part Type: MCU; Status: Zola Dongle; Temperature: -40¡ãC to 85¡ãC
U15 = SKY13317-373LF: IC, Analog Devices, RF Switch, SKY13317-373LF, SON8; Part Reference: U15; Manufacturer: SKYWORKS; Company Part Status: BeaglePlay; PN: 310060642; PCB Footprint: son8p_150x150x50mm; Value: SKY13317-373LF; Temperature: -40¡ãC to 100¡ãC; Status: Zola Dongle; Part Type: Analog Switch; Manufacturer Part Number: SKY13317-373; CLASS: IC; Manufacturer PN: SKY13317-373LF
X3 = XTAL_2P: Crystal, SMD, 32.768kHz, 20 ppm, 7pF; Part Reference: X3; Manufacturer PN: FC-135 32.768KA-AG0; Company Part Status: Combox Pro; Manufacturer: EPSON; CLASS: DISCRETE; Frequency Tolerance: 20 ppm; Rating: 20ppm; PN: 306011026; PCB Footprint: X2_SMD_3_2X1_5MM; Temperature: -40¡ãC to 85¡ãC; Status: Zola Dongle; Part Type: Crystal; Manufacturer Part Number: FC-135 32.768KA-AG0
X4 = XTAL_4P: Crystal, SMD, 48MHz, 10 ppm, 7pF; Part Reference: X4; Manufacturer PN: 5NAA48000071SF50Q2; Company Part Status: MS; Manufacturer: Interquip; CLASS: DISCRETE; Frequency Tolerance: 10 ppm; Rating: 10ppm; PN: 306011062; PCB Footprint: x4_smd_2_0x1_6mm; Temperature: -40¡ãC to 85¡ãC; Status: Zola Dongle; Part Type: Crystal; Manufacturer Part Number: 5NAA48000071SF50Q2